# Altium schematic sheet JTAG_Connector.SchDoc
size A
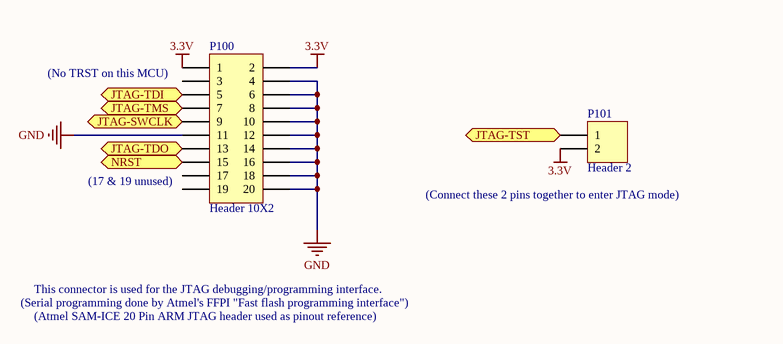
[diagram p0: JTAG_Connector.SchDoc]

## Parts
P100  Header 10X2  [HDR2X10]
P101  Header 2  [HDR1X2]

## Ports
JTAG-SWCLK, JTAG-TDI, JTAG-TDO, JTAG-TMS, JTAG-TST, NRST

## Nets
3.3V: P100.1 P100.2 P101.2
GND: P100.4 P100.6 P100.8 P100.10 P100.11 P100.12 P100.14 P100.16 P100.18 P100.20
JTAG-SWCLK: P100.9 ; port JTAG-SWCLK
JTAG-TDI: P100.5 ; port JTAG-TDI
JTAG-TDO: P100.13 ; port JTAG-TDO
JTAG-TMS: P100.7 ; port JTAG-TMS
JTAG-TST: P101.1 ; port JTAG-TST
NRST: P100.15 ; port NRST

Not connected (* = marked no-connect by the designer): P100 3 17 19

## Notes on the sheet
- (near P100) (No TRST on this MCU)
- (near P100) (17 & 19 unused)
- (near P101) (Connect these 2 pins together to enter JTAG mode)
- (Serial programming done by Atmel's FFPI "Fast flash programming interface")
- This connector is used for the JTAG debugging/programming interface.
- (Atmel SAM-ICE 20 Pin ARM JTAG header used as pinout reference)

## Library data of the parts
P100 = Header 10X2: Header, 10-Pin, Dual row; LatestRevisionDate: 17-Jul-2002; LatestRevisionNote: Re-released for DXP Platform.; Publisher: Altium Limited
P101 = Header 2: Header, 2-Pin; LatestRevisionDate: 17-Jul-2002; LatestRevisionNote: Re-released for DXP Platform.; Publisher: Altium Limited